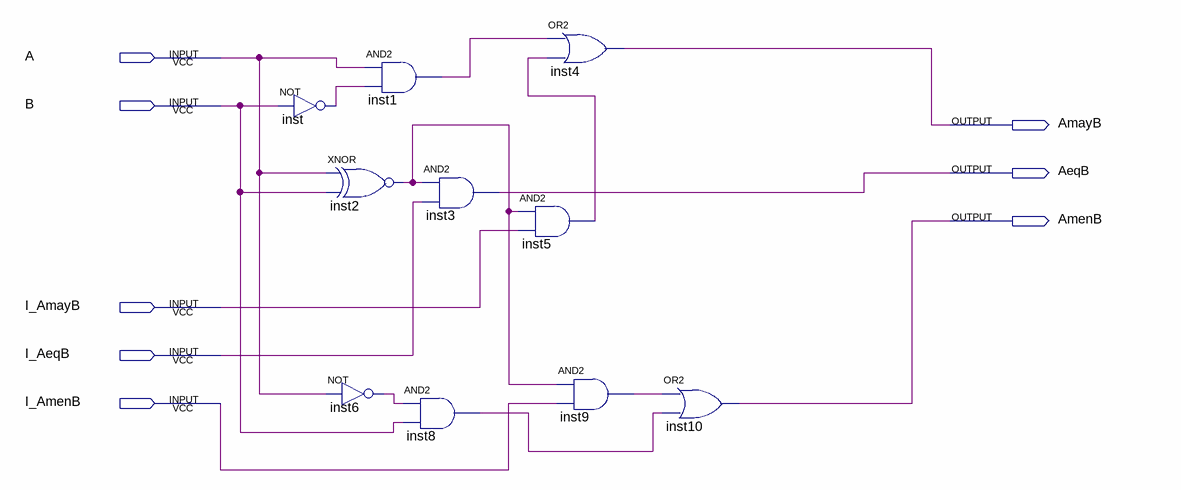
[diagram p0: schematic sheet]
// Quartus schematic comparador_1bit.bdf as structural Verilog: 10 symbols, 8 pins
module comparador_1bit (
  input  A,
  input  B,
  input  I_AmayB,
  input  I_AeqB,
  input  I_AmenB,
  output AmayB,
  output AeqB,
  output AmenB
);

  wire inst1_out, inst2_out, inst5_out, inst6_out, inst8_out, inst9_out, inst_out;

  not inst (inst_out, B);
  and inst1 (inst1_out, A, inst_out);
  xnor inst2 (inst2_out, A, B);
  not inst6 (inst6_out, A);
  and inst3 (AeqB, inst2_out, I_AeqB);
  and inst8 (inst8_out, inst6_out, B);
  and inst5 (inst5_out, inst2_out, I_AmayB);
  or inst4 (AmayB, inst1_out, inst5_out);
  and inst9 (inst9_out, inst2_out, I_AmenB);
  or inst10 (AmenB, inst9_out, inst8_out);
endmodule
